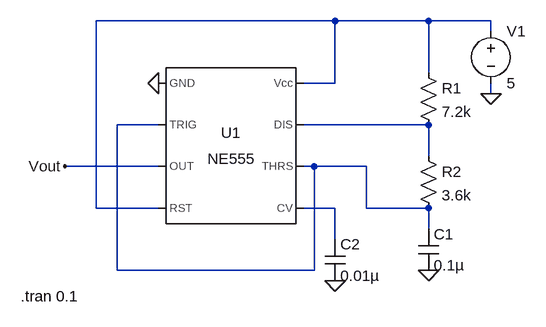
[diagram p0: schematic Asymm.asc]
Asymm.asc, the LTspice schematic file:
Version 4
SHEET 1 880 680
WIRE 400 32 32 32
WIRE 544 32 400 32
WIRE 640 32 544 32
WIRE 640 48 640 32
WIRE 544 112 544 32
WIRE 400 128 400 32
WIRE 400 128 352 128
WIRE 640 144 640 128
WIRE 128 192 64 192
WIRE 544 192 352 192
WIRE 544 240 544 192
WIRE 128 256 -16 256
WIRE 368 256 352 256
WIRE 448 256 368 256
WIRE 32 320 32 32
WIRE 128 320 32 320
WIRE 400 320 352 320
WIRE 448 320 448 256
WIRE 544 320 448 320
WIRE 544 352 544 320
WIRE 400 368 400 320
WIRE 64 416 64 192
WIRE 368 416 368 256
WIRE 368 416 64 416
FLAG 128 128 0
FLAG 640 144 0
FLAG 400 432 0
FLAG 544 416 0
FLAG -16 256 Vout
SYMBOL Misc\\NE555 240 224 R0
SYMATTR InstName U1
SYMBOL voltage 640 32 R0
SYMATTR InstName V1
SYMATTR Value 5
SYMBOL res 528 96 R0
SYMATTR InstName R1
SYMATTR Value 7.2k
SYMBOL res 528 224 R0
SYMATTR InstName R2
SYMATTR Value 3.6k
SYMBOL cap 528 352 R0
SYMATTR InstName C1
SYMATTR Value 0.1µ
SYMBOL cap 384 368 R0
SYMATTR InstName C2
SYMATTR Value 0.01µ
TEXT -84 456 Left 2 !.tran 0.1

The netlist it stands for:
* Asymm.asc
XU1 0 N002 Vout N001 N004 N002 N003 N001 NE555  ; pins GND TRIG OUT RST CV THRS DIS Vcc
V1 N001 0 5
R1 N001 N003 7.2k
R2 N003 N002 3.6k
C1 N002 0 0.1µ
C2 N004 0 0.01µ
.tran 0.1
.lib NE555.sub
.backanno
.end